# EAGLE design BeamMini (EAGLE 7.7.0)

## Sheet 1 of 2
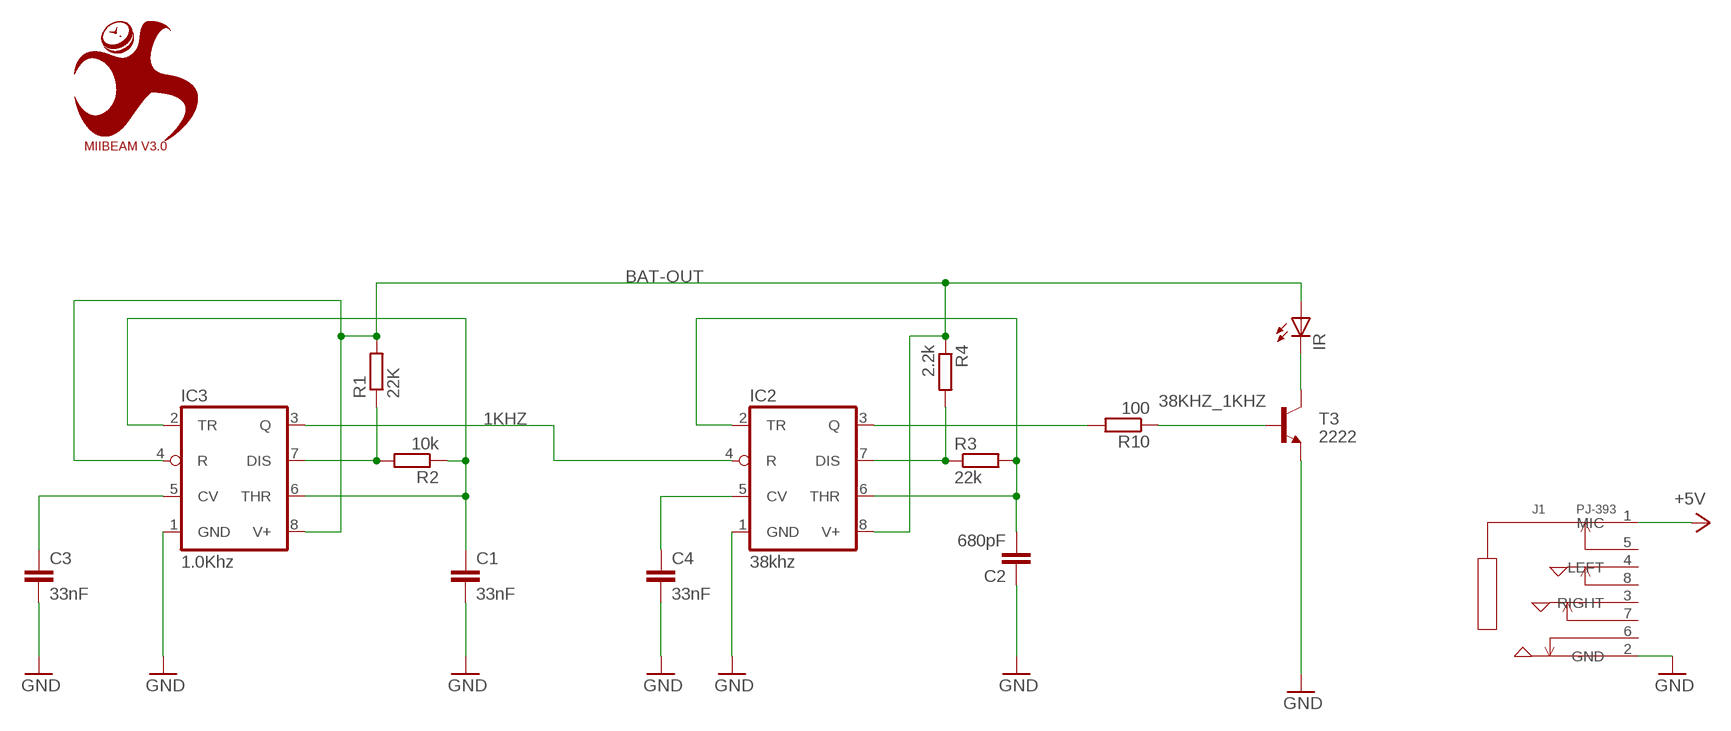
[diagram p0: schematic, sheet 1]

### Parts
C1  33nF  C-EUC0805  [C0805]
C2  680pF  C-EUC0805  [C0805]
C3  33nF  C-EUC0805  [C0805]
C4  33nF  C-EUC0805  [C0805]
IC2  38khz  NE555D  [SO08]
IC3  1.0Khz  NE555D  [SO08]
IR  LED5MM  [LED5MM]
J1  PJ-393  AUDIO-JACK-PJ-393(8P-SMD)  [AUDIO8P-SMD-3.5-14.5X6.1X4.0MM]
R1  22K  R-EU_M0805  [M0805]
R2  10k  R-EU_M0805  [M0805]
R3  22k  R-EU_M0805  [M0805]
R4  2.2k  R-EU_M0805  [M0805]
R10  100  R-EU_M0805  [M0805]
T3  2222  TRANSISTOR_NPNSOT23  [SOT23]
U$1  MIIBEAM V3.0  MIICHRONO  [MIICHRONO]

### Nets
1KHZ: IC2.4(R) IC3.3(Q)
38KHZ_1KHZ: R10.1 T3.1(B)
+5V [supply]: J1.1(MIC) ; also sheet 2
BAT-OUT [supply]: IC2.8(V+) IC3.4(R) IC3.8(V+) IR.A R1.2 R4.1 ; also sheet 2
GND: C1.2 C2.1 C3.2 C4.2 IC2.1(GND) IC3.1(GND) J1.2(GND) T3.2(E) ; also sheet 2
N$1: IC3.7(DIS) R1.1 R2.2
N$2: C3.1 IC3.5(CV)
N$3: C2.2 IC2.2(TR) IC2.6(THR) R3.2
N$4: IC2.7(DIS) R3.1 R4.2
N$6: C4.1 IC2.5(CV)
N$7: IC2.3(Q) R10.2
N$9: C1.1 IC3.2(TR) IC3.6(THR) R2.1
N$11: IR.K(C) T3.3(C)
Unconnected: J1.3(RIGHT) J1.4(LEFT) J1.5 J1.6 J1.7 J1.8

## Sheet 2 of 2
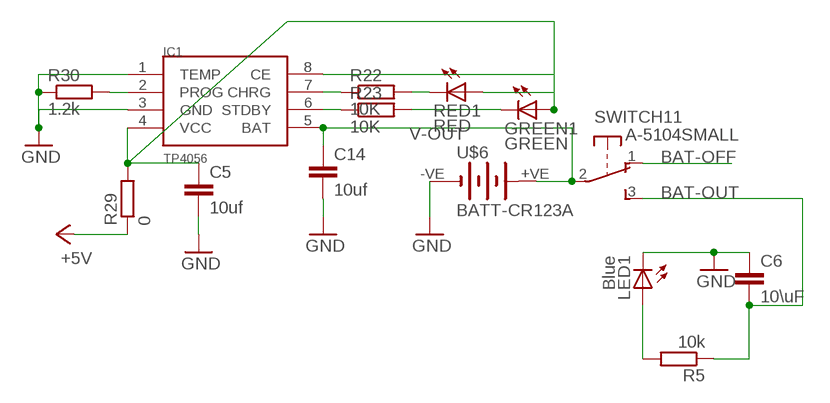
[diagram p1: schematic, sheet 2]

### Parts
C5  10uf  C-EUC0805  [C0805]
C6  10\uF  C-EUC0805  [C0805]
C14  10uf  C-EUC0805  [C0805]
GREEN1  GREEN  LEDCHIP-LED0805  [CHIP-LED0805]
IC1  TP4056  [SOP-8]
LED1  Blue  LEDCHIP-LED0805  [CHIP-LED0805]
R5  10k  R-EU_M0805  [M0805]
R22  10K  R-EU_R0805  [R0805]
R23  10K  R-EU_R0805  [R0805]
R29  0  R-EU_R0805  [R0805]
R30  1.2k  R-EU_R0805  [R0805]
RED1  RED  LEDCHIP-LED0805  [CHIP-LED0805]
SWITCH1  A-5104SMALL  [A-5104-SMALL]
U$6  BATT-CR123A  [KEYSTONE-2/3A]

### Nets
+5V [supply]: R29.1 ; also sheet 1
BAT-OFF [supply]: SWITCH1.1(1:O)
BAT-OUT [supply]: C6.2 R5.1 SWITCH1.3(1:S) ; also sheet 1
GND: C5.2 C6.1 C14.2 IC1.1(TEMP) IC1.3(GND) LED1.C R30.1 U$6.-VE(-) ; also sheet 1
N$5: LED1.A R5.2
N$27: GREEN1.C R23.2
N$28: R22.2 RED1.C
N$29: IC1.7(CHRG) R22.1
N$30: IC1.6(STDBY) R23.1
N$31: IC1.2(PROG) R30.2
V-IN: C5.1 GREEN1.A IC1.4(VCC) IC1.8(CE) R29.2 RED1.A
V-OUT: C14.1 IC1.5(BAT) SWITCH1.2(1:P) U$6.+VE(+)
Unconnected: SWITCH1.MT1(MT) SWITCH1.MT2(MT)

## Library data of the parts
C1-C6 C14 = rcl:C-EU: CAPACITOR, European symbol
GREEN1 IR LED1 RED1 = adafruit:LED: LED OSRAM: - CHIPLED LG R971, LG N971, LY N971, LG Q971, LY Q971, LO R971, LY R971 LH N974, LH R974 LS Q976, LO Q976, LY Q976 LO Q996 - Hyper CHIPLED LW Q18S LB Q993, LB Q99A, LB R99A - SideLED LS A670, LO A670, LY A670, LG A670, LP A670 LB A673, LV A673, LT A673, LW A673 LH A674 LY A675 LS A676, LA A676, LO A676, LY A676, LW A676 LS A679, LY A679, LG A679 - Hyper Micro SIDELED® LS Y876, LA Y876, LO Y876, LY Y876 LT Y87S - SmartLED LW L88C, LW L88S LB L89C, LB L89S, LG L890 LS L89K, LO L89K, LY L89K LS L896, LA L896, LO L896, LY L896 - TOPLED LS T670, LO T670, LY T670, LG T670, LP T670 LSG T670, LSP T670, LSY T670, LOP T670, LYG T670 LG T671, LOG T671, LSG T671 LB T673, LV T673, LT T673, LW T673 LH T674 LS T676, LA T676, LO T676, LY T676, LB T676, LH T676, LSB T676, LW T676 LB T67C, LV T67C, LT T67C, LS T67K, LO T67K, LY T67K, LW E67C LS E67B, LA E67B, LO E67B, LY E67B, LB E67C, LV E67C, LT E67C LW T67C LS T679, LY T679, LG T679 LS T770, LO T770, LY T770, LG T770, LP T770 LB T773, LV T773, LT T773, LW T773 LH T774 LS E675, LA E675, LY E675, LS T675 LS T776, LA T776, LO T776, LY T776, LB T776 LHGB T686 LT T68C, LB T68C - Hyper Mini TOPLED® LB M676 - Mini TOPLED Santana® LG M470 LS M47K, LO M47K, LY M47K Source: http://www.osram.convergy.de/
IC1 = TP4056:TP4056
IC2 IC3 = adafruit:*555: TIMER Changed DIP package to have round (not oval) pin pads http://www.ladyada.net/library/pcb/eaglelibrary.html
J1 = MyLib:AUDIO-JACK-PJ-393(8P-SMD): 320040009; MPN: PJ-393
R1-R5 R10 = rcl:R-EU_: RESISTOR, European symbol
R22 R23 R29 R30 = rcl:R-EU_: RESISTOR, European symbol; NOTE: WAS 120
SWITCH1 = MyLib:A-5104: E-Switch right-angle slide SPDT Ebay and taydaElectronics A-5014
T3 = SparkFun:TRANSISTOR_NPN: Transistor NPN BJT configuration in SOT23 package. MMBT2222 is the common NPN we use. Double check BCE configuration again layout.
U$1 = MyLib:MIICHRONO
U$6 = eagle-library-edeca:BATT-CR123A: CR123A (2/3rd AA) battery holder Manufacturer: Keystone Mouser part: 534-1019

## Net classes
0 default: width 0.203 mm
1 supply: width 0.254 mm

## Board
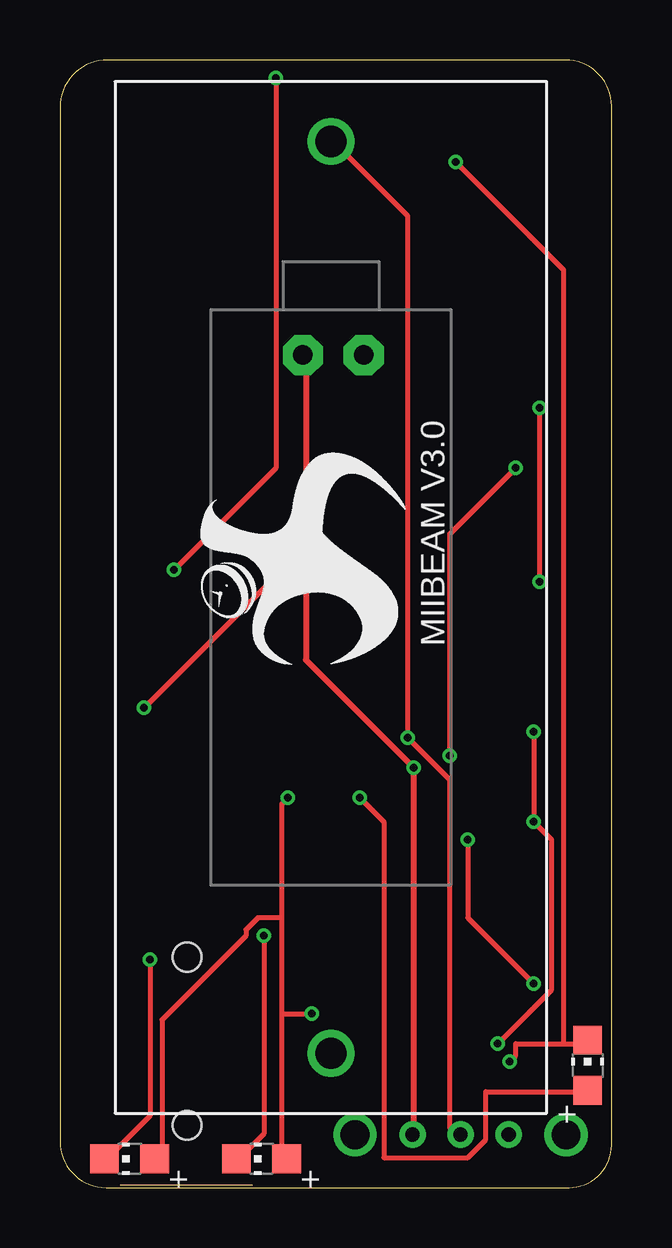
[diagram p2: board, top side]
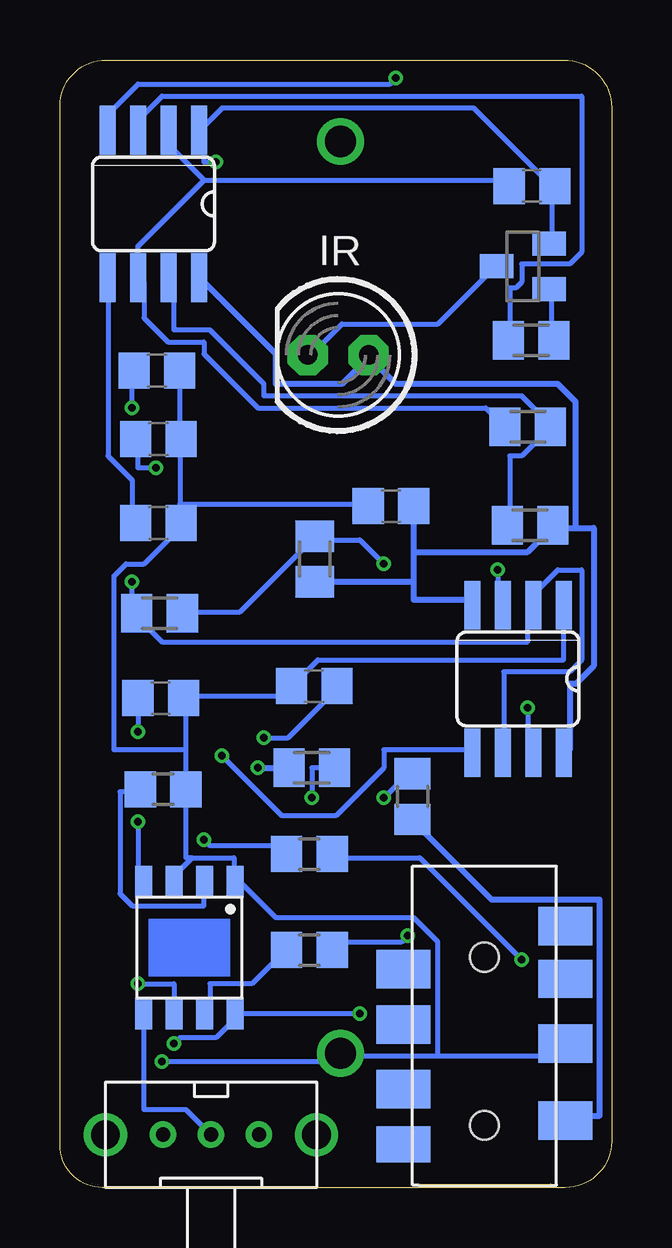
[diagram p3: board, bottom side, seen from below]

Size 23 x 47 mm. Coordinates in mm from the lower left corner, seen from the top.
Outline: 23,1.77 23,45.08 arc90 21.08,47 1.98,47 arc90 0,45.02 0,1.92 arc90 1.92,0 21.23,0 arc90 23,1.77
Copper layers (1*16): Top 0.035mm / dielectric 1.5mm / Bottom 0.035mm
Design rules "ITEADstudio_DRC": minimum track width 6mil, minimum drill 12mil, track to track 6mil, track to pad 6mil, pad to pad 6mil, via to via 6mil, smd to smd 0mil, copper to edge 10mil, drill to drill 10mil, minimum pad ring 10mil, minimum via ring 6mil, stop-mask expansion 2mil, vias tented up to drill 100mil, thermal gap 10mil

### Footprints (pad centres in the part's own frame; a part is rotated, then mirrored left to right if it is on the bottom)
C0805 = smd 1.3 x 1.5: 1 -0.95,0; 2 0.95,0
CHIP-LED0805 = smd 1.2 x 1.2: A 0,-1.05; C 0,1.05
SOP-8 = smd 1.3 x 0.7: 1 -2.75,1.905; 2 -2.75,0.635; 3 -2.75,-0.635; 4 -2.75,-1.905; 5 2.75,-1.905; 6 2.75,-0.635; 7 2.75,0.635; 8 2.75,1.905
SO08 = smd 0.66 x 2.032: 1 -1.905,-3.073; 2 -0.635,-3.073; 3 0.635,-3.073; 4 1.905,-3.073; 5 1.905,3.073; 6 0.635,3.073; 7 -0.635,3.073; 8 -1.905,3.073
LED5MM = drill 0.813 pad 1.676 octagon: A -1.27,0; K 1.27,0
AUDIO8P-SMD-3.5-14.5X6.1X4.0MM = smd 1.6 x 2.25: 1 3.9,-3.375; 2 7.1,-3.375; 3 9.8,-3.375; 4 10.2,3.375; 6 5.2,3.375; 7 7.9,3.375; 8 12,-3.375 | smd 1.5 x 2.25: 5 2.9,3.375 | hole 1.2: 3.7,0; 10.7,0
M0805 = smd 1.3 x 1.6: 1 -0.95,0; 2 0.95,0
R0805 = smd 1.3 x 1.5: 1 -0.95,0; 2 0.95,0
A-5104-SMALL = drill 0.6: 1 -2,0; 2 0,0; 3 2,0 | drill 1.2: MT1 -4.4,0; MT2 4.4,0
SOT23 = smd 1 x 1.4: 1 -0.95,-1.1; 2 0.95,-1.1; 3 0,1.1
KEYSTONE-2/3A = drill 1.3: +VE 0,19; -VE 0,-19

### Placement (x,y rotation side)
C1  18.96,34.05 0 bottom
C2  3.32,41.75 180 bottom
C3  18.9,31.2 0 bottom
C4  18.9,27.7 0 bottom
C5  18.8,20.4 0 bottom
C6  9.2,28.4 0 bottom
C14  12.4,20.9 180 bottom
GREEN1  2.9,1.2 90 top
IC1  17.6,10 270 bottom
IC2  19.1,41 180 bottom
IC3  3.9,21.2 180 bottom
IR  11.4,34.7 180 bottom
J1  5.3,-1.1 90 bottom
LED1  22,5.1 0 top
R1  12.37,26.2 270 bottom
R2  18.85,23.93 0 bottom
R3  3.5,31.72 180 bottom
R4  3.4,27.6 180 bottom
R5  12.5,17.5 0 bottom
R10  3.35,35.32 180 bottom
R22  12.6,9.9 0 bottom
R23  12.6,13.9 0 bottom
R29  8.3,16.3 90 bottom
R30  18.7,16.6 180 bottom
RED1  8.4,1.2 90 top
SWITCH1  16.7,2.2 0 bottom
T3  3.7,38.4 90 bottom
U$1  14.4,21.8 90 top
U$6  11.3,24.6 0 top

### Tracks (layer width: path | path; a pad name or v marks a point on that pad's centre or on a via)
1KHZ  (via drill 0.3)
  Top 0.203: v4.75,25.75 9,30 v9,46.25
  Bottom 0.203: v4.75,25.75 4.75,24.5 IC3.3 | v9,46.25 9.25,46 19.75,46 21,44.75 21,44.25 IC2.4
38KHZ_1KHZ
  Bottom 0.203: T3.1 2.5,37.25 2.5,35.5 R10.1
+5V
  Bottom 0.254: R29.1 8.25,15.25 5,12 0.5,12 0.5,3 1.75,3 J1.1
BAT-OUT  (via drill 0.3)
  Top 0.254: SWITCH1.3 14.75,2.25 v14.75,17.5 10.25,22 10.25,34.5 IR.A
  Bottom 0.254: v14.75,17.5 R5.1 | IC2.8 17,37.75 14,34.75 14,33.5 11.25,33.5 10.25,34.5 IR.A 10,34.5 9,33.5 2.25,33.5 1.5,32.75 1.5,27.5 | 8.25,25.25 8.25,24.5 6,24.5 IC3.4 | 8.25,25.25 8.25,26.5 | 8.25,26.5 C6.2 | 8.25,26.5 3.5,26.5 2.5,27.5 R4.1 2.25,27.5 1.5,27.5 | 8.25,25.25 12.25,25.25 R1.2 | 1.5,27.5 0.75,27.5 0.75,21.75 1.5,21 1.75,21 1.75,18.25 IC3.8
GND  (via drill 0.3)
  Top 0.203: 21,6 19,6 19,5.5 v18.75,5.25 | 21,6 22,6 LED1.C | v16.5,42.75 21,38.25 21,6
  Bottom 0.203: 18,28.5 18,31 C3.2 18,31.25 18,34 C1.2 | 18,28.5 18,27.75 C4.2 18,27.5 19.5,26 20.25,26 20.75,25.5 20.75,18.25 17.75,18.25 | 18,28.5 10.25,28.5 C6.1 | 17.5,13.75 15.75,13.75 15.75,12.75 IC1.1 15.5,12.75 14,11.25 8.25,11.25 7.25,10.25 7.25,5.5 | 17.5,13.75 18,13.25 18,12.75 IC1.3 | 17.5,13.75 17.75,13.75 R30.1 17.75,18.25 | 17.75,18.25 17.75,20.25 C5.2 17.75,20.5 13.75,20.5 C14.2 12.25,22 2,22 2,24.25 IC3.1 | 2.5,41.75 2.5,39.5 T3.2 | 2.5,41.75 5.75,45 16.25,45 17,44.25 IC2.1 17,44 17,42.75 v16.5,42.75 | 2.5,41.75 C2.1 | v18.75,5.25 11.75,5.25 11.5,5.5 U$6.-VE 11.25,5.5 7.25,5.5 | 7.25,5.5 2.5,5.5 2,6 J1.2
N$1  (via drill 0.3)
  Top 0.203: v9.5,26 v3.5,20
  Bottom 0.203: R2.2 17.75,24 15.5,24 12.5,27 R1.1 12.25,27 10.5,27 v9.5,26 | v3.5,20 3.5,18.25 IC3.7
N$2  (via drill 0.3)
  Top 0.203: v19,30 16.25,27.25 v16.25,18
  Bottom 0.203: v19,30 19.75,30 19.75,31 C3.1 | v16.25,18 13.75,15.5 11.5,15.5 9.5,17.5 9.5,18.25 6,18.25 IC3.5
N$3
  Bottom 0.203: 17,42 4.75,42 4.5,41.75 C2.2 | 17,42 18.25,43.25 18.25,44 IC2.2 | R3.2 4.5,31.75 5.25,32.5 14.75,32.5 17,34.75 17,35.25 18.5,35.25 19.5,36.25 19.5,37.75 IC2.6 19.75,38 19.75,39.25 17,42
N$4
  Bottom 0.203: R4.2 4.25,27.75 4.25,30.5 3.75,30.5 2.75,31.5 R3.1 2.5,31.75 3.75,33 14.5,33 14.5,33.5 16.75,35.75 18.25,35.75 18.25,37.75 IC2.7
N$5  (via drill 0.3)
  Top 0.203: v12.5,16.25 13.5,15.25 13.5,1.25 17,1.25 17.75,2 17.75,4 22,4 LED1.A
  Bottom 0.203: v12.5,16.25 12.5,17.5 R5.2
N$6
  Bottom 0.203: C4.1 20,27.75 20,29.5 21,30.5 21,37.75 IC2.5
N$7
  Bottom 0.203: R10.2 4.25,35.5 4.25,37.5 4,37.5 3.75,37.75 3.75,38.5 1.75,38.5 1.25,39 1.25,45.5 18.75,45.5 19.5,44.75 19.5,44.25 IC2.3
N$9  (via drill 0.3)
  Top 0.203: v20,25.25 v20,32.5
  Bottom 0.203: IC3.6 4.5,18.25 4.5,21.5 1.75,21.5 1.25,22 1.25,25.75 2.25,25.75 3.5,24.5 IC3.2 3.5,24.25 3.5,22.75 18.75,22.75 19.75,23.75 R2.1 20,24 v20,25.25 | v20,32.5 20,34 C1.1
N$11
  Bottom 0.203: T3.3 5,38.25 7.25,36 11.25,36 12.5,34.75 IR.K
N$27  (via drill 0.3)
  Top 0.203: v3.75,9.5 3.75,3 2,1.25 GREEN1.C
  Bottom 0.203: v3.75,9.5 8,13.75 11.5,13.75 R23.2
N$28  (via drill 0.3)
  Top 0.203: v8.5,10.5 8.5,2.25 7.5,1.25 RED1.C
  Bottom 0.203: v8.5,10.5 8.75,10.25 11.25,10.25 11.5,10 R22.2
N$29
  Bottom 0.203: IC1.7 16.75,7.25 16.75,8.5 15,8.5 13.75,9.75 R22.1
N$30  (via drill 0.3)
  Top 0.203: v19.75,8.5 17,11.25 v17,14.5
  Bottom 0.203: v19.75,8.5 18.25,8.5 IC1.6 | v17,14.5 16.75,14.25 14,14.25 13.75,14 R23.1
N$31
  Bottom 0.203: IC1.2 17,12.75 17,11.75 20,11.75 20.5,12.25 20.5,16.5 19.75,16.5 R30.2
V-IN  (via drill 0.3)
  Top 0.203: v19.75,19 v19.75,15.25 20.5,14.5 20.5,8.25 v18.25,6 | GREEN1.A 4.25,1.5 4.25,7 7.75,10.5 7.75,10.75 8.25,11.25 9.25,11.25 | 9.25,7.25 9.25,1.25 RED1.A | 9.25,7.25 9.25,11.25 | 9.25,7.25 v10.5,7.25 | v9.5,16.25 9.25,16 9.25,11.25
  Bottom 0.203: v19.75,15.25 19.75,12.75 IC1.4 | C5.1 v19.75,19 | v10.5,7.25 15.5,7.25 | v9.5,16.25 8.5,17.25 R29.2 | v18.25,6 18,6.25 16.5,6.25 15.5,7.25 | 15.5,7.25 IC1.8
V-OUT  (via drill 0.3)
  Top 0.203: SWITCH1.2 16.5,2.25 16.25,2.5 16.25,17 v14.5,18.75 14.5,40.5 11.5,43.5 U$6.+VE
  Bottom 0.203: SWITCH1.2 17.75,3.25 19.5,3.25 IC1.5 | v14.5,18.75 13.5,18.75 11.5,20.75 C14.1